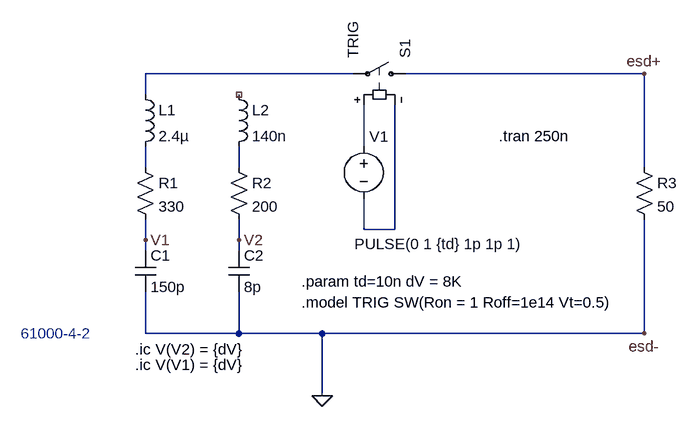
[diagram p0: schematic esd-gun-model.asc]
esd-gun-model.asc, the LTspice schematic file:
Version 4.1
SHEET 1 880 680
WIRE 352 48 32 48
WIRE 800 48 432 48
WIRE 32 80 32 48
WIRE 368 160 368 96
WIRE 32 192 32 160
WIRE 176 192 176 160
WIRE 800 192 800 48
WIRE 368 288 368 240
WIRE 416 288 416 96
WIRE 416 288 368 288
WIRE 32 304 32 272
WIRE 176 304 176 272
WIRE 32 320 32 304
WIRE 176 320 176 304
WIRE 32 448 32 384
WIRE 176 448 176 384
WIRE 176 448 32 448
WIRE 304 448 176 448
WIRE 800 448 800 272
WIRE 800 448 304 448
WIRE 304 544 304 448
FLAG 32 304 V1
FLAG 176 304 V2
FLAG 304 544 0
FLAG 800 48 esd+
FLAG 800 448 esd-
SYMBOL ind 16 64 R0
SYMATTR InstName L1
SYMATTR Value 2.4µ
SYMBOL ind 160 64 R0
SYMATTR InstName L2
SYMATTR Value 140n
SYMBOL res 16 176 R0
SYMATTR InstName R1
SYMATTR Value 330
SYMBOL res 160 176 R0
SYMATTR InstName R2
SYMATTR Value 200
SYMBOL cap 16 320 R0
SYMATTR InstName C1
SYMATTR Value 150p
SYMBOL cap 160 320 R0
SYMATTR InstName C2
SYMATTR Value 8p
SYMBOL voltage 368 144 R0
WINDOW 0 9 1 Left 2
WINDOW 3 -14 166 Left 2
WINDOW 123 0 0 Left 0
WINDOW 39 0 0 Left 0
SYMATTR InstName V1
SYMATTR Value PULSE(0 1 {td} 1p 1p 1)
SYMBOL sw 448 48 M270
SYMATTR InstName S1
SYMATTR Value TRIG
SYMBOL res 784 176 R0
SYMATTR InstName R3
SYMATTR Value 50
TEXT -160 448 Left 2 ;61000-4-2
TEXT 272 368 Left 2 !.param td=10n dV = 8K
TEXT 272 400 Left 2 !.model TRIG SW(Ron = 1 Roff=1e14 Vt=0.5)
TEXT 16 472 Left 2 !.ic V(V2) = {dV}
TEXT 16 496 Left 2 !.ic V(V1) = {dV}
TEXT 576 144 Left 2 !.tran 250n

The netlist it stands for:
* esd-gun-model.asc
L1 N001 N003 2.4µ
L2 NC_01 N004 140n
R1 N003 V1 330
R2 N004 V2 200
C1 V1 0 150p
C2 V2 0 8p
V1 N002 N005 PULSE(0 1 {td} 1p 1p 1)
S1 esd+ N001 N002 N005 TRIG
R3 esd+ 0 50
* 61000-4-2
.param td=10n dV = 8K
.model TRIG SW(Ron = 1 Roff=1e14 Vt=0.5)
.ic V(V2) = {dV}
.ic V(V1) = {dV}
.tran 250n
.backanno
.end